# Altium schematic sheet EJ8_ANALOG_SCH.SchDoc
size A
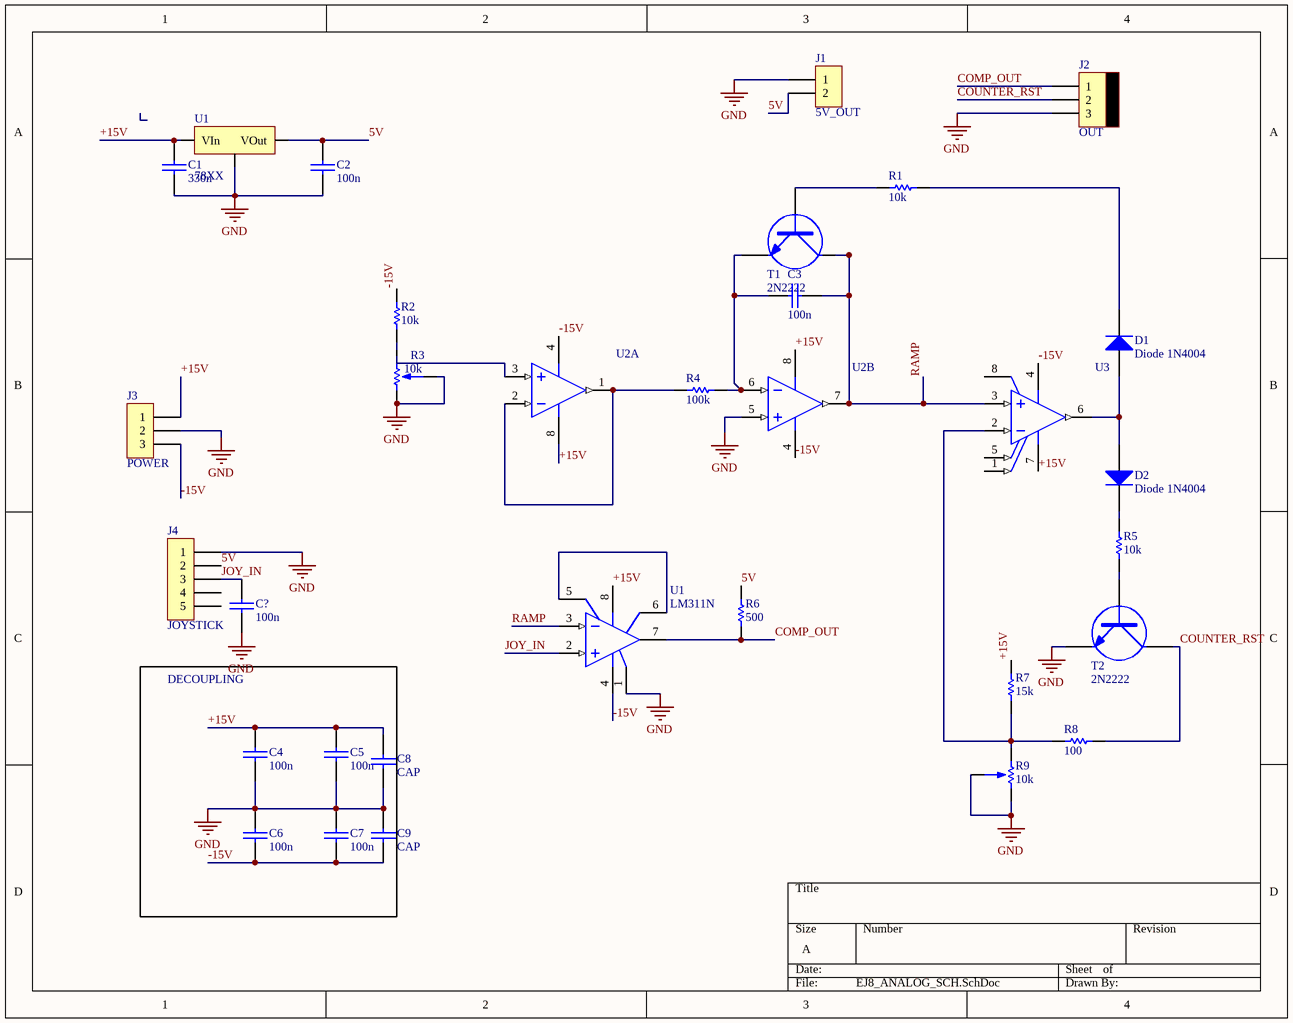
[diagram p0: EJ8_ANALOG_SCH.SchDoc]

## Parts
(Parts that share a designator on the sheet are numbered #1, #2 ... from top to bottom, then left to right.)
C1  330n  [CAP200]
C2  100n  [CAP200]
C3  100n  [CAP200]
C4  100n  [0805]
C5  100n  [0805]
C6  100n  [0805]
C7  100n  [0805]
C8  CAP  [0805]
C9  CAP  [0805]
C?  100n  [0805]
D1  Diode 1N4004  [DO-41]
D2  Diode 1N4004  [DO-41]
J1  5V_OUT  [BORNERA2]
J2  OUT  [MOLEX3]
J3  POWER  [BORNERA3]
J4  JOYSTICK  [SIP5]
R1  10k  [0805]
R2  10k  [0805]
R3  10k  [PRESET V]
R4  100k  [RES300]
R5  10k  [0805]
R6  500  [0805]
R7  15k  [RES300]
R8  100  [0805]
R9  10k  [PRESET V]
T1  2N2222  [TO18]
T2  2N2222  [TO18]
U1#1  78XX  [TO-220 V]
U1#2  LM311N  [DIP8]
U2  (no value)  [TI-P8]  (parts A,B of 2)
U3  (no value)  [TI-P8]

## Blocks framed on the sheet
DECOUPLING: C4-C9

## Nets
GND: C1.2 C2.2 C4.2 C5.2 C6.1 C7.1 C8.2 C9.1 C?.2 J1.1 J2.3 J3.2 J4.1 R3.2 R3.3 R9.1 R9.2 T2.2(E) U1#1.2(GND) U1#2.1(GND) U2.5(IN2+)
5V: C2.1 J1.2 J4.2 R6.2 U1#1.3(VOut)
+15V: C1.1 C4.1 C5.1 C8.1 J3.1 R7.2 U1#1.1(VIn) U1#2.8(V+) U2.8(VCC+) U3.7(VCC+)
-15V: C6.2 C7.2 C9.2 J3.3 R2.2 U1#2.4(V-_(CASE)) U2.4(VCC-) U3.4(VCC-)
COMP_OUT: J2.1 R6.1 U1#2.7(OUT)
COUNTER_RST: J2.2 R8.2 T2.3(C)
JOY_IN: C?.1 J4.3 U1#2.2(IN+)
RAMP: C3.2 T1.3(C) U1#2.3(IN-) U2.7(OUT2) U3.3(IN+)
NetC3_1: C3.1 R4.2 T1.2(E) U2.6(IN2-)
NetD1_1: D1.1(A) D2.1(A) U3.6(OUT)
NetD1_2: D1.2(K) R1.2
NetD2_2: D2.2(K) R5.2
NetR1_1: R1.1 T1.1(B)
NetR2_1: R2.1 R3.1
NetR4_1: R4.1 U2.1(OUT1) U2.2(IN1-)
NetR5_1: R5.1 T2.1(B)
NetR7_1: R7.1 R8.1 R9.3 U3.2(IN-)
NetU1#2_5: U1#2.5(BAL) U1#2.6(BAL/STB)

Not connected (* = marked no-connect by the designer): J4 4 5; U2 3(IN1+); U3 1(OFFSET_N1) 5(OFFSET_N2) 8(NC)

## Library data of the parts
C1-C7 C? = CAP
D1 D2 = Diode 1N4004: 1 Amp General Purpose Rectifier; Published: 8-Jun-2000; LatestRevisionDate: 17-Jul-2002; LatestRevisionNote: Re-released for DXP Platform.; DatasheetVersion: 1998; PackageVersion: Aug-1999; PackageReference: DO-41; Publisher: Altium Limited; PackageDescription: Diode, Axial; Body 5.2 x 2.7 mm (LxDia. max), Lead Dia. 0.86 mm (max); Code_JEDEC: DO-204-AL; ComponentLink1Description: Manufacturer Link; ComponentLink1URL: http://www.fairchildsemi.com/; ComponentLink2Description: Datasheet; ComponentLink2URL: http://www.fairchildsemi.com/ds/1N%2F1N4001.pdf
J1 = BORNERA 2
J2 = MOLEX3
J3 = BORNERA 3
J4 = CON5
R1 R2 R4-R8 = RES
R3 R9 = PRESET
U1#1 = 78XX: REGULDOR POSITIVO
U1#2 = LM311N: Voltage Comparator; Published: 24-Aug-2001; LatestRevisionDate: 06-Jun-2005; LatestRevisionNote: Stylized 3D Model Added.; DatasheetVersion: Oct-1997; PackageReference: DIP8; Publisher: Altium Limited; PackageDescription: DIP; 8 Leads; Row Spacing 7.62 mm; Pitch 2.54 mm; Code_JEDEC: MO-001-AN; ComponentLink1Description: Manufacturer Link; ComponentLink1URL: http://www.st.com/; ComponentLink2Description: Datasheet; ComponentLink2URL: http://www.st.com/stonline/products/literature/ds/4848/lm211.pdf
U2 = TL082CP: JFET-Input Operational Amplifier, 7 to 36 V, 0 to 70 degC, 8-pin DIP (P8), Pb-Free (RoHS); Manufacturer: Texas Instruments; CMRR(Min)(dB): 70; GBW(Typ)(MHz): 3; IIB(Max)(pA): 400; Iq per channel(Max)(mA): 2.8; Number of Channels: 2; Offset Drift(Typ)(uV/C): 18; Rating: Catalog; Slew Rate(Typ)(V/us): 13; Sub Family: General Purpose Amplifier, High Supply Voltage Amplifier (>=30V); Total Supply Voltage(Max)(+5V is 5, +/-5V is 10): 36; Total Supply Voltage(Min)(+5V is 5, +/-5V is 10): 7; Vio (25C)(Max)(mV): 15; DatasheetVersion: SLOS081G; PackageVersion: 4040082/E, 04/2010; PackageReference: P8; PackageDescription: 8-Pin Plastic In-Line, Body 9.59 x 6.35 mm, Pitch 2.54 mm; Supplier 1: Digi-Key; Supplier Part Number 1: 296-1780-5-ND; Supplier 2: Farnell; Supplier Part Number 2: 1106017; Supplier 3: Newark; Supplier Part Number 3: 60K6991; Supplier 4: Mouser; Supplier Part Number 4: 595-TL082CP; Eco-Plan: Pb-Free (RoHS); Vn at 1kHz(Typ)(nV/rtHz): 18; Mounting Technology: Through Hole; Code_JEDEC: MS-001; PartNumber: TL082CP; ComponentLink1Description: Manufacturer URL; ComponentLink1URL: http://www.ti.com/; ComponentLink2Description: Datasheet; ComponentLink2URL: http://www.ti.com/lit/ds/symlink/tl082.pdf; ComponentLink3Description: Package Specification; ComponentLink3URL: http://www.ti.com/litv/pdf/mpdi001b; Supplier 5: Mouser; Supplier Part Number 5: N/A
U3 = TL081CP: JFET-Input Operational Amplifier, 7 to 36 V, 0 to 70 degC, 8-pin DIP (P8), Pb-Free (RoHS); Manufacturer: Texas Instruments; CMRR(Min)(dB): 70; GBW(Typ)(MHz): 3; IIB(Max)(pA): 400; Iq per channel(Max)(mA): 2.8; Number of Channels: 1; Offset Drift(Typ)(uV/C): 18; Rating: Military; Slew Rate(Typ)(V/us): 13; Sub Family: General Purpose Amplifier, High Supply Voltage Amplifier (>=30V); Total Supply Voltage(Max)(+5V is 5, +/-5V is 10): 36; Total Supply Voltage(Min)(+5V is 5, +/-5V is 10): 7; Vio (25C)(Max)(mV): 15; DatasheetVersion: SLOS081G; PackageVersion: 4040082/E, 04/2010; PackageReference: P8; PackageDescription: 8-Pin Plastic In-Line, Body 9.59 x 6.35 mm, Pitch 2.54 mm; Supplier 1: Digi-Key; Supplier Part Number 1: 296-7203-5-ND; Supplier 2: Farnell; Supplier Part Number 2: 1103002; Supplier 3: Newark; Supplier Part Number 3: 08F9317; Supplier 4: Mouser; Supplier Part Number 4: 595-TL081CP; Eco-Plan: Pb-Free (RoHS); Vn at 1kHz(Typ)(nV/rtHz): 18; Mounting Technology: Through Hole; Code_JEDEC: MS-001; PartNumber: TL081CP; ComponentLink1Description: Manufacturer URL; ComponentLink1URL: http://www.ti.com/; ComponentLink2Description: Datasheet; ComponentLink2URL: http://www.ti.com/lit/ds/symlink/tl081.pdf; ComponentLink3Description: Package Specification; ComponentLink3URL: http://www.ti.com/litv/pdf/mpdi001b